# EAGLE design usb-power-switch (EAGLE 7.3.0)
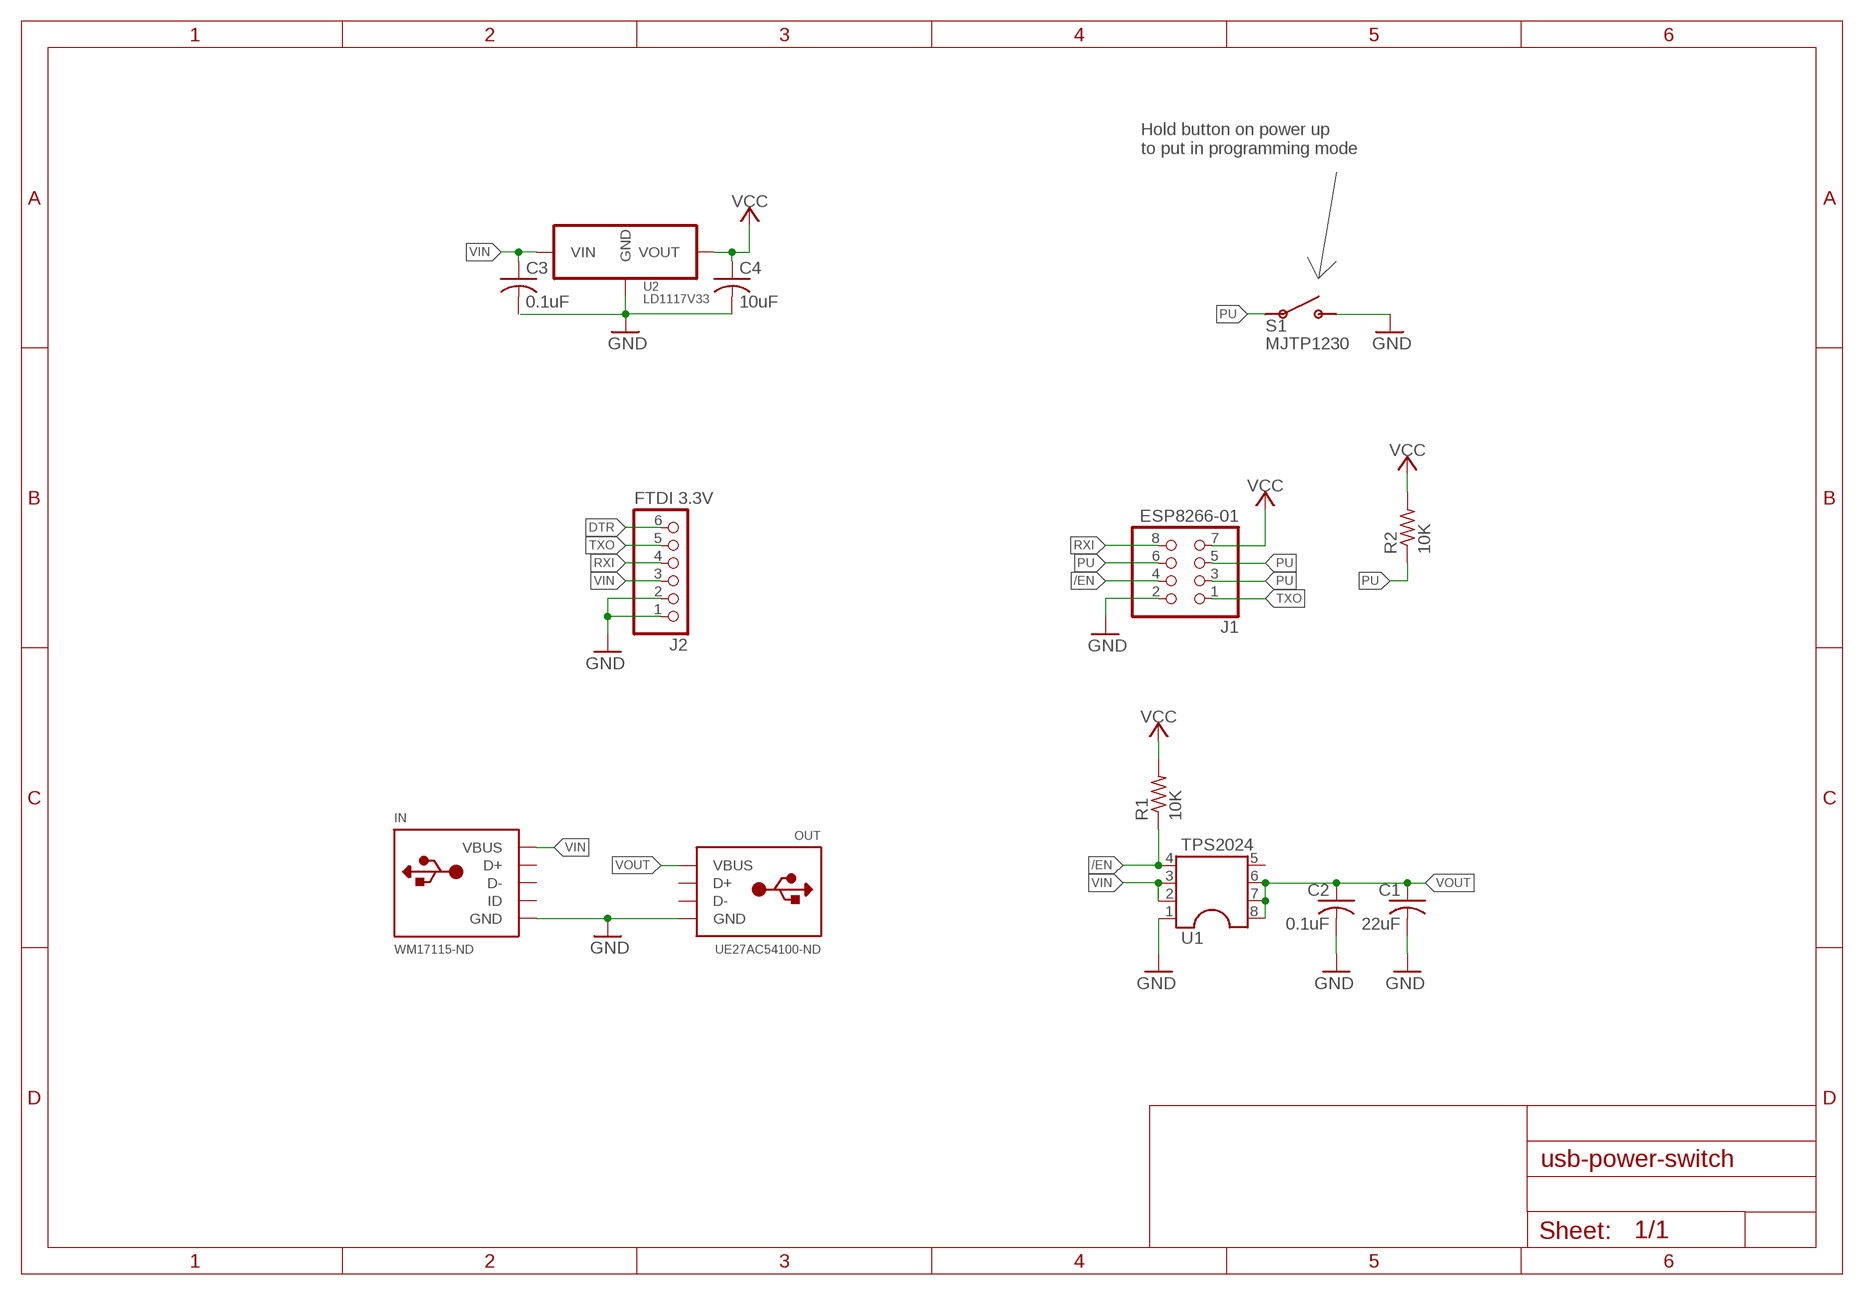
[diagram p0: schematic, sheet 1]

## Parts
C1  22uF  C-US025-025X050  [C025-025X050]
C2  0.1uF  C-US025-025X050  [C025-025X050]
C3  0.1uF  C-US025-025X050  [C025-025X050]
C4  10uF  C-US025-025X050  [C025-025X050]
IN  WM17115-ND  USB-MINI-B  [USB-MINI-B]
J1  ESP8266-01  PINHD-2X4  [2X04]
J2  FTDI 3.3V  PINHD-1X6  [1X06]
OUT  UE27AC54100-ND  USB-A  [USB-A]
R1  10K  R-US_0207/10  [0207/10]
R2  10K  R-US_0207/10  [0207/10]
S1  MJTP1230  TACTILE-BUTTON-MJTP1230  [TACTILE-BUTTON-MJTP1230]
U1  TPS2024  DIL8  [DIL08]
U2  LD1117V33  LD1117  [TO-220]

## Nets
/EN: J1.4 R1.1 U1.4
DTR: J2.6
GND: C1.2 C2.2 C4.2 IN.GND IN.GND1(GND) IN.GND4(GND) J1.2 J2.1 J2.2 OUT.P$4(GND) OUT.P$5(GND) OUT.P$6(GND) S1.P$2 S1.P$4 U1.1 U2.P$1(GND)
PU: J1.3 J1.5 J1.6 R2.1 S1.P$1 S1.P$3
RXI: J1.8 J2.4
TXO: J1.1 J2.5
VCC: C4.1 J1.7 R1.2 R2.2 U2.P$2(VOUT) U2.P$4(VOUT)
VIN: C3.1 IN.VBUS J2.3 U1.2 U1.3 U2.P$3(VIN)
VOUT: C1.1 C2.1 OUT.P$1(VBUS) U1.6 U1.7 U1.8
Unconnected: C3.2 IN.D+ IN.D- IN.ID OUT.P$2(D-) OUT.P$3(D+) U1.5

## Notes on the sheet
- Hold button on power up
  to put in programming mode

## Library data of the parts
C1-C4 = rcl:C-US: CAPACITOR, American symbol
IN = my-custom:USB-MINI-B: USB Connectors USBMINIB - Surface Mount Female Mini-B USB Connector 4UConnector: 06564 By microbuilder.eu Thru-hole RA Female Mini-B USB Connector 4UConnector: 18732 By ladyada.net
J1 = pinhead:PINHD-2X4: PIN HEADER
J2 = pinhead:PINHD-1X6: PIN HEADER
OUT = my-custom:USB-A: USB type A 'plug' Used for things that can directly connect to a USB port, say USB key
R1 R2 = rcl:R-US_: RESISTOR, American symbol
S1 = my-custom:TACTILE-BUTTON-MJTP1230
U1 = ic-package:DIL8: Dual In Line / Socket
U2 = my-custom:LD1117

## Board
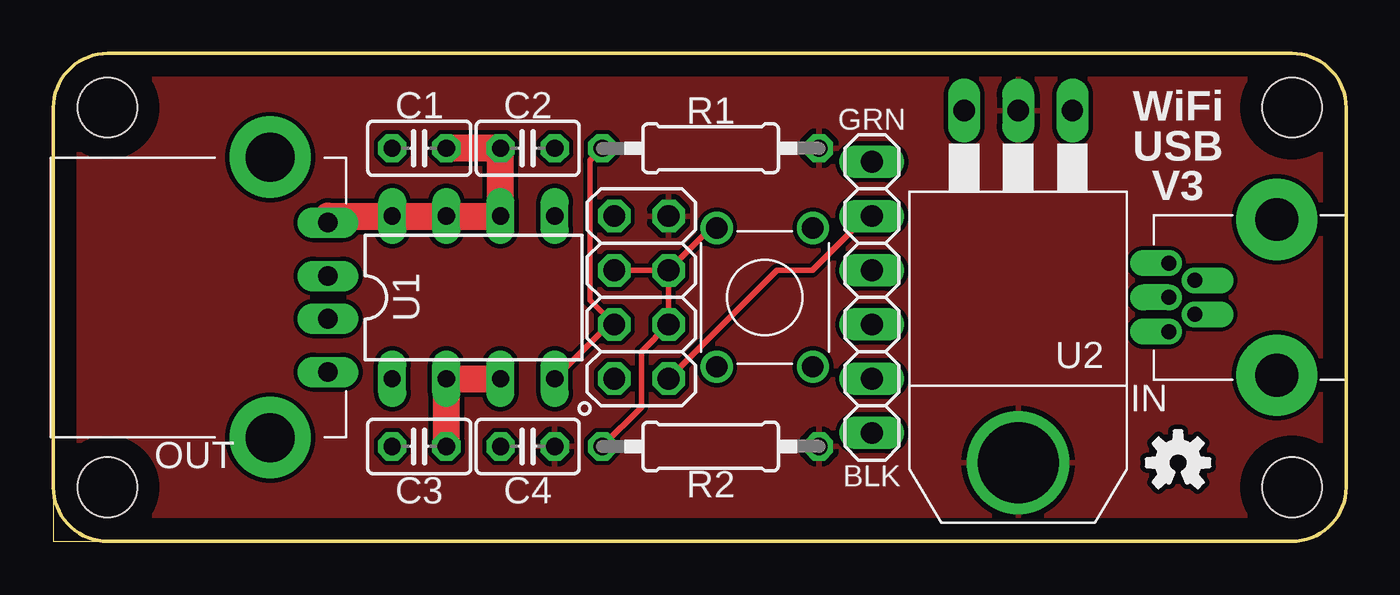
[diagram p1: board, top side]
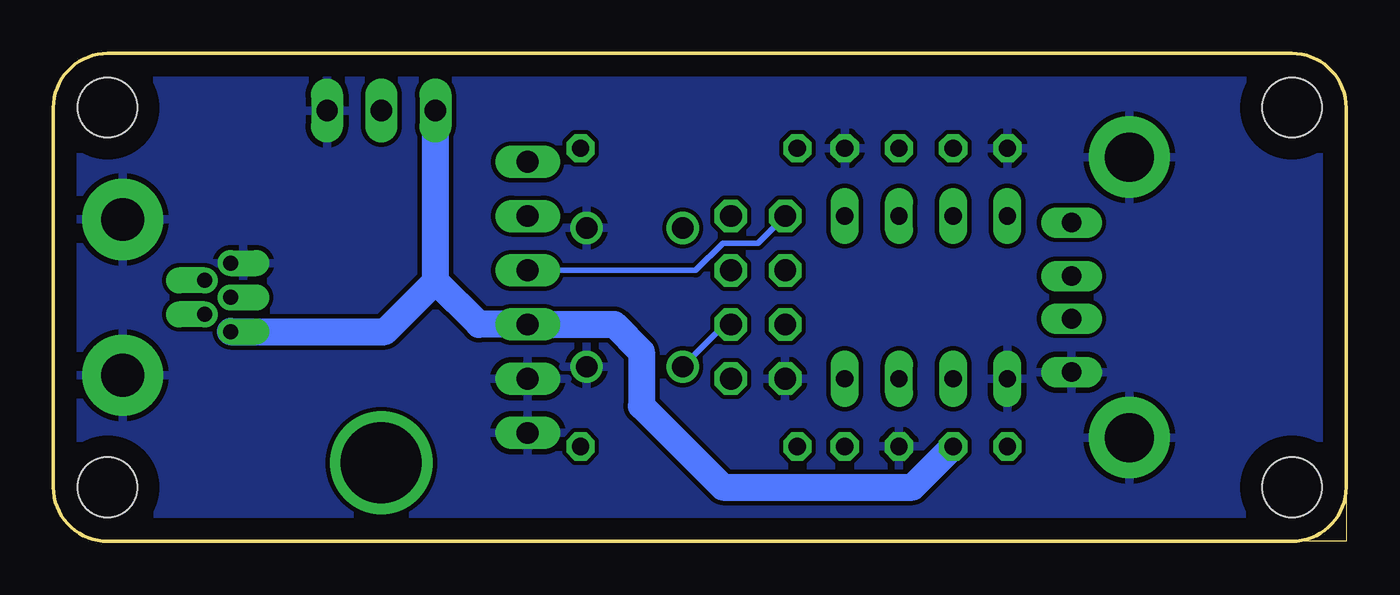
[diagram p2: board, bottom side, seen from below]

Size 60.58 x 22.86 mm. Coordinates in mm from the lower left corner, seen from the top.
Outline: 2.54,0 0,0 0,2.54
Outline: 2.54,0 58.04,0 arc90 60.58,2.54 60.58,20.32 arc90 58.04,22.86 2.54,22.86 arc90 0,20.32 0,2.54
Outline: 0,2.54 arc90 2.54,0
Copper layers (1*16): Top 0.035mm / dielectric 1.5mm / Bottom 0.035mm
Design rules "default": minimum track width 10mil, minimum drill 24mil, track to track 8mil, track to pad 8mil, pad to pad 8mil, via to via 8mil, smd to smd 8mil, copper to edge 40mil, drill to drill 8mil, minimum pad ring 10mil, minimum via ring 8mil, stop-mask expansion 4mil, vias tented up to drill 0mil, thermal gap 10mil
Holes 2.79 mm at 2.54,20.32 58.04,20.32 58.04,2.54 2.54,2.54

### Footprints (pad centres in the part's own frame; a part is rotated, then mirrored left to right if it is on the bottom)
C025-025X050 = drill 0.813 octagon: 1 -1.27,0; 2 1.27,0
USB-MINI-B = drill 0.7 offset: D+ 0,5.125; D- -0.8,3.925; GND 1.6,5.125; ID 0.8,3.925; VBUS -1.6,5.125 | drill 2 pad 3.81: GND1 -3.65,0.075; GND4 3.65,0.075
2X04 = drill 1.016 octagon: 1 -3.81,-1.27; 2 -3.81,1.27; 3 -1.27,-1.27; 4 -1.27,1.27; 5 1.27,-1.27; 6 1.27,1.27; 7 3.81,-1.27; 8 3.81,1.27
1X06 = drill 1.016 long: 1 -6.35,0; 2 -3.81,0; 3 -1.27,0; 4 1.27,0; 5 3.81,0; 6 6.35,0
USB-A = drill 0.92 long: P$1 -3.5,2.71; P$2 -1,2.71; P$3 1,2.71; P$4 3.5,2.71 | drill 2.3 pad 3.81: P$5 -6.57,0; P$6 6.57,0
0207/10 = drill 0.813 octagon: 1 -5.08,0; 2 5.08,0
TACTILE-BUTTON-MJTP1230 = drill 1: P$1 -3.25,2.25; P$2 -3.25,-2.25; P$3 3.25,2.25; P$4 3.25,-2.25
DIL08 = drill 0.813 long: 1 -3.81,-3.81; 2 -1.27,-3.81; 3 1.27,-3.81; 4 3.81,-3.81; 5 3.81,3.81; 6 1.27,3.81; 7 -1.27,3.81; 8 -3.81,3.81
TO-220 = drill 1 long: P$1 -2.54,-3.8; P$2 0,-3.8; P$3 2.54,-3.8 | drill 3.8: P$4 0,12.7

### Placement (x,y rotation side)
C1  17.14,18.41 180 top
C2  22.23,18.41 0 top
C3  17.14,4.45 180 top
C4  22.23,4.45 180 top
IN  57.4,11.43 90 top
J1  27.56,11.43 90 top
J2  38.35,11.43 90 top
OUT  10.16,11.43 270 top
R1  30.8,18.41 0 top
R2  30.8,4.45 0 top
S1  33.34,11.43 90 top
U1  19.68,11.43 0 top
U2  45.21,16.38 180 top
U$1  [OSHW-LOGO-S]  52.7,3.68 0 top
U$2  [OSHW-LOGO-S_COPPER]  52.7,3.68 0 top

### Tracks (layer width: path | path; a pad name or v marks a point on that pad's centre or on a via)
/EN
  Top 0.254: U1.4 26.04,10.16 J1.4 25.15,11.3 25.15,17.84 R1.1
GND
  pour Bottom: 0,0 60.58,0 60.58,22.86 0,22.86
PU
  Top 0.254: J1.5 30.81,14.68 S1.P$3 | J1.6 J1.5 | J1.5 J1.3 27.56,8.89 27.56,6.29 R2.1
  Bottom 0.254: J1.3 29.11,10.16 S1.P$1
RXI
  Bottom 0.254: J1.8 27.56,13.97 29.21,13.97 30.48,12.7 J2.4
TXO
  Top 0.254: J1.1 33.91,12.7 35.56,12.7 38.1,15.24 J2.5
VCC
  pour Top: 0,22.86 60.58,22.86 60.58,0.13 60.58,0 0,0
VIN
  Top 1.27: C3.1 U1.2 U1.3
  Bottom 1.27: 42.67,12.19 U2.P$3 | 42.67,12.19 40.64,10.16 J2.3 34.29,10.16 33.02,8.89 33.02,6.35 29.21,2.54 20.32,2.54 C3.1 | IN.VBUS 45.03,9.83 42.67,12.19
VOUT
  Top 1.27: OUT.P$1 12.87,15.24 U1.8 U1.7 U1.6 C2.1 C1.1

### Text on the board
tPlace: GRN | WiFi / USB / V3 | BLK